# Altium project MARK1_EDU_PMOD.PrjPcb
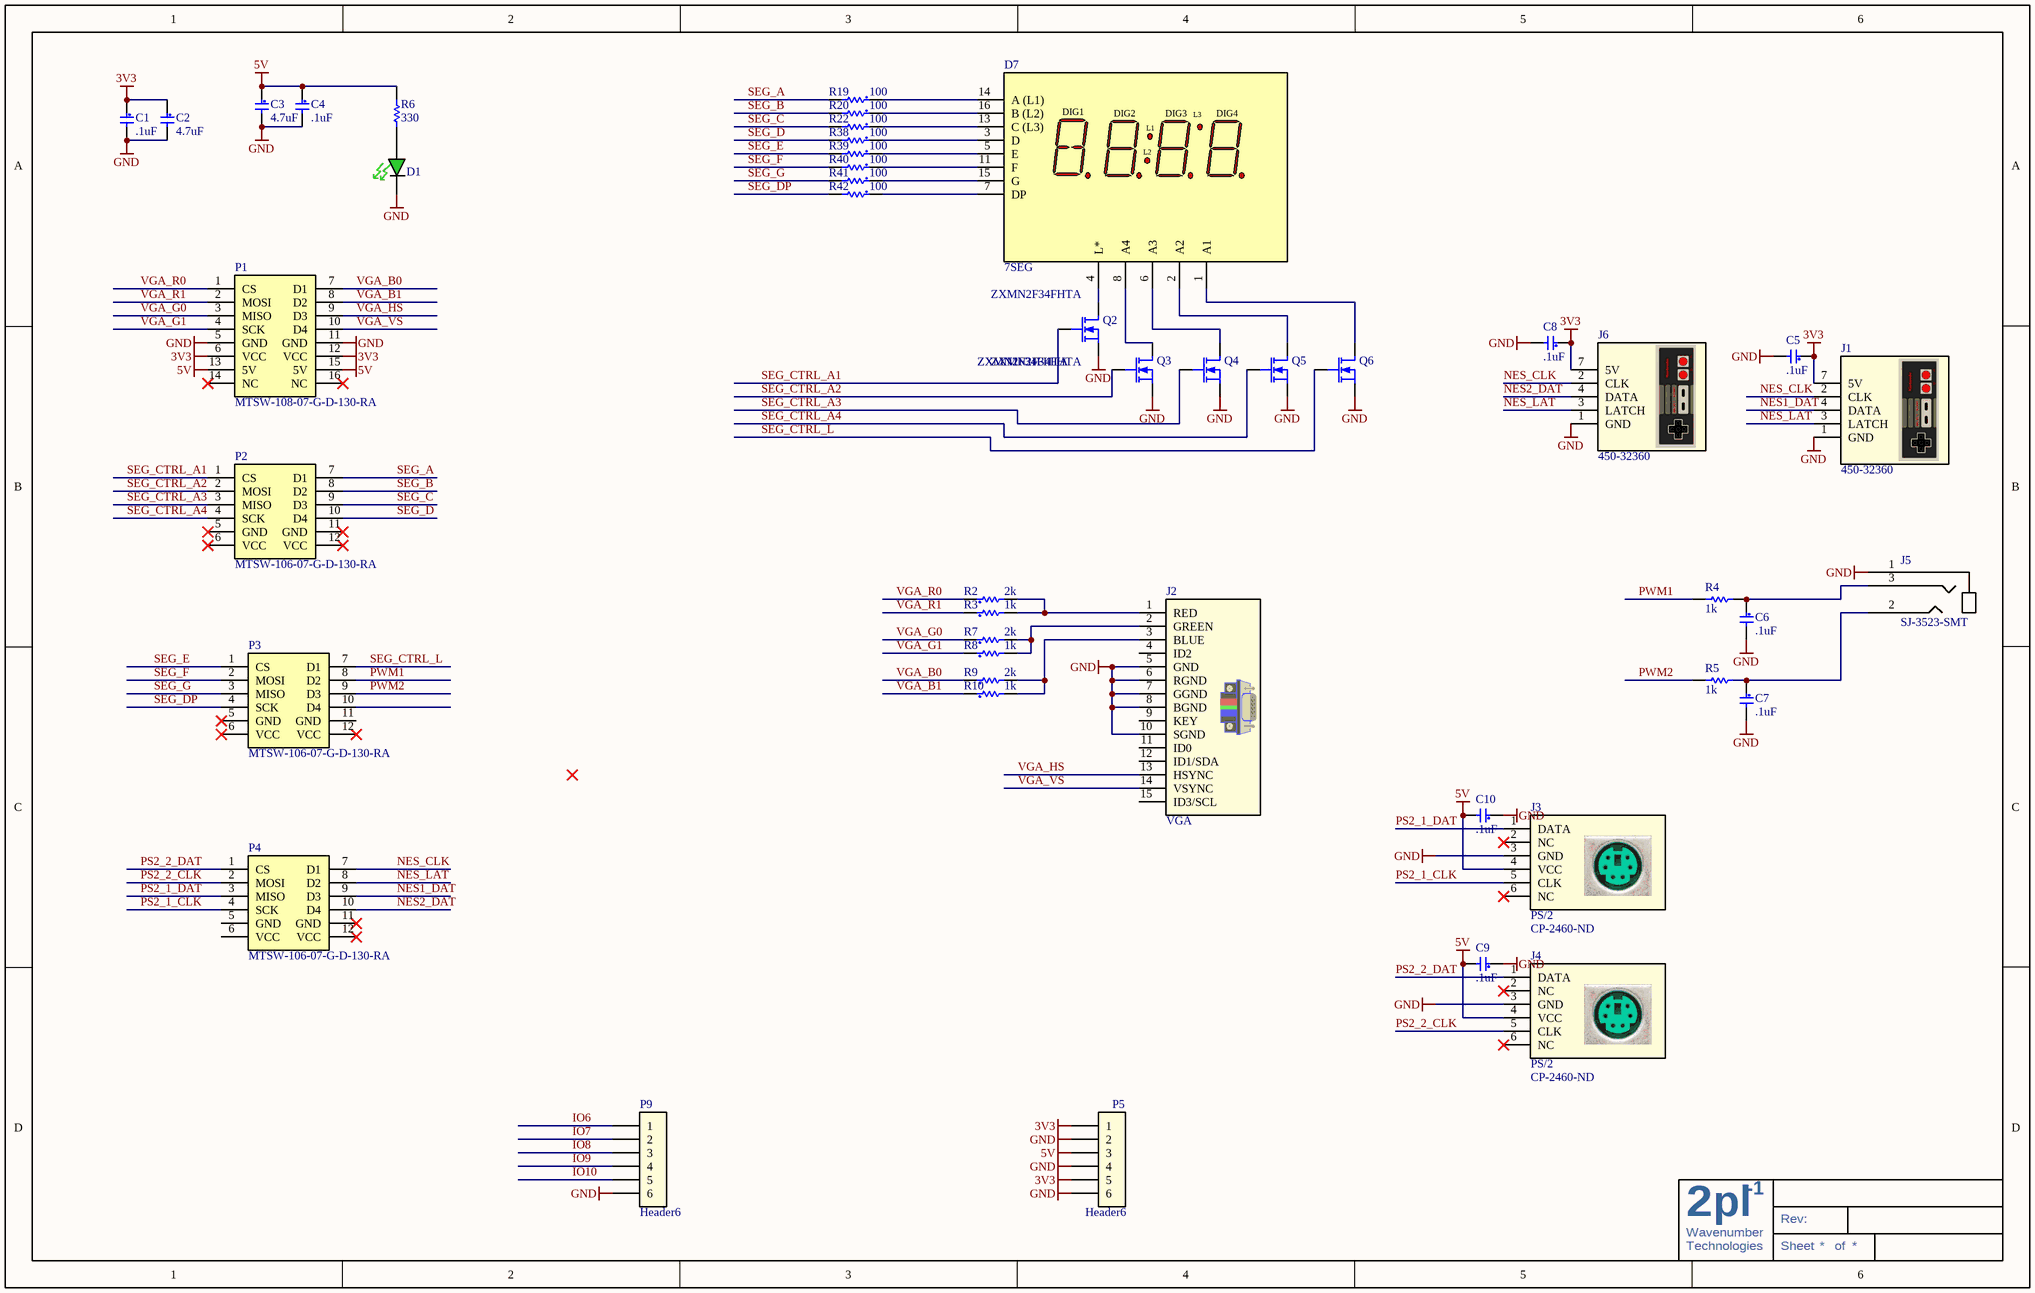
[diagram p0: MARK1_EDU_PMOD.SchDoc]
1 sheet, 46 parts. Net scope: global (net labels, ports and power ports of the same name join across sheets).
Board file: MARK1_EDU_PMOD.PcbDoc

## Sheet MARK1_EDU_PMOD.SchDoc
size B

### Parts
C1  .1uF  [C0603]
C2  4.7uF  [C0603]
C3  4.7uF  [C0603]
C4  .1uF  [C0603]
C5  .1uF  [C0603]
C6  .1uF  [C0603]
C7  .1uF  [C0603]
C8  .1uF  [C0603]
C9  .1uF  [C0603]
C10  .1uF  [C0603]
D1  LED 1.6X0.8MM 570NM GRN CLR SMD  [LED_0603 - GREEN]  (value not drawn)
D7  7SEG  [LED - SSEG - LTC-4727JR]
J1  450-32360  [NES - 450-32360]
J2  VGA  [1-1734530-1]
J3  PS/2  Supplier Part Number 1: CP-2460-ND  [MD-60S - PS/2]
J4  PS/2  Supplier Part Number 1: CP-2460-ND  [MD-60S - PS/2]
J5  SJ-3523-SMT  [SJ-3523-SMT]
J6  450-32360  [NES - 450-32360]
P1  MTSW-108-07-G-D-130-RA  [PMOD HEADER - MTSW-108-07-G-D-130-RA]
P2  MTSW-106-07-G-D-130-RA  [PMOD HEADER - Male]
P3  MTSW-106-07-G-D-130-RA  [PMOD HEADER - Male]
P4  MTSW-106-07-G-D-130-RA  [PMOD HEADER - Male]
P5  Header6  [HEADER_6_40_100 THRU SIP]
P9  Header6  [HEADER_6_40_100 THRU SIP]
Q2  ZXMN2F34FHTA  [SOT-23]
Q3  ZXMN2F34FHTA  [SOT-23]
Q4  ZXMN2F34FHTA  [SOT-23]
Q5  ZXMN2F34FHTA  [SOT-23]
Q6  ZXMN2F34FHTA  [SOT-23]  (value not drawn)
R2  2k  [R0603]
R3  1k  [R0603]
R4  1k  [R0603]
R5  1k  [R0603]
R6  330  [R0603]
R7  2k  [R0603]
R8  1k  [R0603]
R9  2k  [R0603]
R10  1k  [R0603]
R19  100  [R0603]
R20  100  [R0603]
R22  100  [R0603]
R38  100  [R0603]
R39  100  [R0603]
R40  100  [R0603]
R41  100  [R0603]
R42  100  [R0603]

### Nets
3V3: C1.1 C2.1 C5.1 C8.1 J1.7(5V) J6.7(5V) P1.6(VCC) P1.12(VCC) P5.1 P5.5
5V: C3.1 C4.1 C9.2 C10.2 J3.4(VCC) J4.4(VCC) P1.13(5V) P1.15(5V) P5.3 R6.1
GND: C1.2 C2.2 C3.2 C4.2 C5.2 C6.2 C7.2 C8.2 C9.1 C10.1 D1.C J1.1(GND) J2.5(GND) J2.6(RGND) J2.7(GGND) J2.8(BGND) J2.10(SGND) J3.3(GND) J4.3(GND) J5.1 J6.1(GND) P1.5(GND) P1.11(GND) P5.2 P5.4 P5.6 P9.6 Q2.2 Q3.2 Q4.2 Q5.2 Q6.2
IO6: P9.1
IO7: P9.2
IO8: P9.3
IO9: P9.4
IO10: P9.5
NES1_DAT: J1.4(DATA) P4.9(D3)
NES2_DAT: J6.4(DATA) P4.10(D4)
NES_CLK: J1.2(CLK) J6.2(CLK) P4.7(D1)
NES_LAT: J1.3(LATCH) J6.3(LATCH) P4.8(D2)
PS2_1_CLK: J3.5(CLK) P4.4(SCK)
PS2_1_DAT: J3.1(DATA) P4.3(MISO)
PS2_2_CLK: J4.5(CLK) P4.2(MOSI)
PS2_2_DAT: J4.1(DATA) P4.1(CS)
PWM1: P3.8(D2) R4.1
PWM2: P3.9(D3) R5.1
SEG_A: P2.7(D1) R19.2
SEG_B: P2.8(D2) R20.2
SEG_C: P2.9(D3) R22.2
SEG_CTRL_A1: P2.1(CS) Q2.1(G)
SEG_CTRL_A2: P2.2(MOSI) Q3.1(G)
SEG_CTRL_A3: P2.3(MISO) Q4.1(G)
SEG_CTRL_A4: P2.4(SCK) Q5.1(G)
SEG_CTRL_L: P3.7(D1) Q6.1(G)
SEG_D: P2.10(D4) R38.2
SEG_DP: P3.4(SCK) R42.2
SEG_E: P3.1(CS) R39.2
SEG_F: P3.2(MOSI) R40.2
SEG_G: P3.3(MISO) R41.2
VGA_B0: P1.7(D1) R9.1
VGA_B1: P1.8(D2) R10.1
VGA_G0: P1.3(MISO) R7.1
VGA_G1: P1.4(SCK) R8.1
VGA_HS: J2.13(HSYNC) P1.9(D3)
VGA_R0: P1.1(CS) R2.1
VGA_R1: P1.2(MOSI) R3.1
VGA_VS: J2.14(VSYNC) P1.10(D4)
NetC6_1: C6.1 J5.3 R4.2
NetC7_1: C7.1 J5.2 R5.2
NetD1_A: D1.A R6.2
NetD7_1: D7.1(A1) Q6.3(D)
NetD7_2: D7.2(A2) Q5.3(D)
NetD7_3: D7.3(D) R38.1
NetD7_4: D7.4(L*) Q2.3(D)
NetD7_5: D7.5(E) R39.1
NetD7_6: D7.6(A3) Q4.3(D)
NetD7_7: D7.7(DP) R42.1
NetD7_8: D7.8(A4) Q3.3(D)
NetD7_11: D7.11(F) R40.1
NetD7_13: D7.13(C_(L3)) R22.1
NetD7_14: D7.14(A_(L1)) R19.1
NetD7_15: D7.15(G) R41.1
NetD7_16: D7.16(B_(L2)) R20.1
NetJ2_1: J2.1(RED) R2.2 R3.2
NetJ2_2: J2.2(GREEN) R7.2 R8.2
NetJ2_3: J2.3(BLUE) R9.2 R10.2

Not connected (* = marked no-connect by the designer): J2 4(ID2) 9(KEY) 11(ID0) 12(ID1/SDA) 15(ID3/SCL); J3 2(NC)* 6(NC)*; J4 2(NC)* 6(NC)*; P1 14(NC)* 16(NC)*; P2 5(GND)* 6(VCC)* 11(GND)* 12(VCC)*; P3 5(GND)* 6(VCC)* 10(D4) 11(GND) 12(VCC)*; P4 5(GND) 6(VCC) 11(GND)* 12(VCC)*

### Notes on the sheet
- 2
- Wavenumber
- pl
- -1
- Rev:
- Technologies
- Sheet
- of
- (in symbol LED - SSEG - LTC-4727JR) DIG1; DIG2; DIG3; L3; DIG4; L1; L2

### Library data of the parts
C1 C4-C10 = C0603 - GRM188R71H104KA93D: 0.1uF 50volts X7R 10% MLCC SMD/SMT 0603; Manufacturer: Murata; Description: Multilayer Ceramic Capacitors (MLCC) - SMD/SMT 0603 0.1uF 50volts X7R 10%; Supplier 1: Mouser; Manufacturer Part Number: GRM188R71H104KA93D; RoHS: RoHS Compliant By Exemption; Category: Multilayer Ceramic Capacitors (MLCC) - SMD/SMT; Stock 1: 327594; Pricing 1: 1=0.081, 50=0.054, 100=0.041, 500=0.018, 1000=0.015, 4000=0.012 (AUD); Capacitance: 0.1 uF; Dimensions: 0.8 mm W x 1.6 mm L x 0.8 mm H; Operating Temperature Range: - 55 C to + 125 C; Package / Case: 0603 (1608 metric); Packaging: Reel; Product: General Type MLCCs; Series: GRM; Termination Style: SMD/SMT; Tolerance: 10 %; Voltage Rating: 50 Volts; Product Category: Low & Medium Capacitance SMD Ceramic Chip Capacitors; Standard Pack Qty: 4000; Temperature Coefficient / Code: X7R; RoHS - Mouser: E; Minimum Order Quantity: 1; Reeling: True; ComponentLink1URL: http://www.murata.com/products/catalog/pdf/c02e.pdf; ComponentLink1Description: http://www.murata.com/products/catalog/pdf/c02e.pdf; Supplier Part Number 1: 81-GRM39X104K50D; Value: .1uF
C2 C3 = C0603 - GRM188F51A475ZE20D: 4.7uF 10volts Y5V +80-20% (MLCC) - SMD/SMT 0603; Manufacturer: Murata; Description: Multilayer Ceramic Capacitors (MLCC) - SMD/SMT 0603 4.7uF 10volts Y5V +80-20%; Tolerance: - 20 %, + 80 %; Supplier 1: Mouser; Manufacturer Part Number: GRM188F51A475ZE20D; RoHS: RoHS Compliant By Exemption; Category: Multilayer Ceramic Capacitors (MLCC) - SMD/SMT; Stock 1: 32662; Pricing 1: 1=0.257, 50=0.159, 100=0.123, 500=0.065, 1000=0.046, 4000=0.032, 8000=0.028, 12000=0.024 (AUD); Capacitance: 4.7 uF; Dimensions: 0.8 mm W x 1.6 mm L x 0.8 mm H; Operating Temperature Range: - 30 C to + 85 C; Package / Case: 0603 (1608 metric); Packaging: Reel; Product: General Type MLCCs; Series: GRM; Termination Style: SMD/SMT; Voltage Rating: 10 Volts; Product Category: High Capacitance SMD Ceramic Chip Capacitors; Standard Pack Qty: 4000; Temperature Coefficient / Code: Y5V; RoHS - Mouser: E; Minimum Order Quantity: 1; Reeling: True; ComponentLink1URL: http://www.murata.com/products/catalog/pdf/c02e.pdf; ComponentLink1Description: http://www.murata.com/products/catalog/pdf/c02e.pdf; Supplier Part Number 1: 81-GRM188F51A475ZE20; Value: 4.7uF
D1 = APT1608CGCK: Manufacturer: Kingbright Corp; Color: Green; Current - Test: 20mA; Wavelength - Peak: 574nm; Millicandela Rating: 50mcd; Voltage - Forward (Vf) Typ: 2.1V; Lens Type: Clear; Lens Style/Size: Rectangle, 1.2mm x 0.8mm; Viewing Angle: 120°; Value: LED 1.6X0.8MM 570NM GRN CLR SMD; Supplier 1: Digi-Key; Supplier Part Number 1: 754-1116-2-ND; Manufacturer Part Number: APT1608CGCK; RoHS: RoHS Compliant; Description: LED 1.6X0.8MM 570NM GRN CLR SMD; Category: Optoelectronics; Stock 1: 94000; Pricing 1: 2000=0.051, 6000=0.045, 10000=0.043 (USD); Luminous Flux @ Current - Test: -; Wavelength - Dominant: 570nm; Size / Dimension: 1.60mm L x 0.80mm W; Height: 0.75mm; Package / Case: 0603 (1608 Metric); Mounting Type: Surface Mount; Packaging: Tape & Reel (TR); ComponentLink1URL: http://www.us.kingbright.com/images/catalog/SPEC/APT1608CGCK.pdf; ComponentLink1Description: http://www.us.kingbright.com/images/catalog/SPEC/APT1608CGCK.pdf
D7 = LED - SSEG - LTC-4727JR: LED Displays & Accessories 4 Digit, Red Low Current; Manufacturer: Lite-On; Character Size: 10 mm; Display Type: 7 Segment; Operating Voltage: 2 V; Power Consumption: 70 mW; Wavelength: 631 nm; Common Pin: Common Cathode; Luminous Intensity: 975 ucd; Operating Current: 25 mA; Number of Digits: 4; Supplier 1: Mouser; Manufacturer Part Number: LTC-4727JR; RoHS: RoHS Compliant; Category: LED Displays & Accessories; Stock 1: 1398; Pricing 1: 1=2.88, 10=2.74, 50=2.67, 100=2.61, 500=2.31 (AUD); Illumination Color: Red; Packaging: Tube; Maximum Operating Temperature: + 85 C; Minimum Operating Temperature: - 35 C; Product Category: Numeric Display; Standard Pack Qty: 12; RoHS - Mouser: Y; Minimum Order Quantity: 1; Reeling: False; ComponentLink1URL: http://optoelectronics.liteon.com/en-us/product/detail.aspx?txtSpecNo=DS30-2000-193&txtPartNo=LTC-4727JR; ComponentLink1Description: http://optoelectronics.liteon.com/en-us/product/detail.aspx?txtSpecNo=DS30-2000-193&txtPartNo=LTC-4727JR
J1 J6 = 450-32360: NES CONTROLLER SOCKET; Manufacturer: Parallax Inc; Accessory Type: Adapter NES Controller Socket; For Use With/Related Products: Game Systems, Development, Hobby and Education Projects; Supplier 1: Digi-Key; Manufacturer Part Number: 450-32360; RoHS: RoHS Compliant; Category: Programmers, Development Systems; Stock 1: 7; Pricing 1: 1=1.99 (USD); Supplier 2: Mouser; Stock 2: 0; Pricing 2: 1=1.85 (USD); Product Category: Basic Stamp Accessories; RoHS - Mouser: Y; Minimum Order Quantity: 1; Reeling: False; Supplier Part Number 1: 450-32360-ND; Supplier Part Number 2: 619-450-32360; Value: 450-32360
J2 = VGA - 1-1734530-1: CONN HD D-SUB RCPT R/A 15POS; Manufacturer: TE Connectivity; Connector Style: D-Sub, High Density; Number of Positions: 15; Connector Type: Receptacle, Female Sockets; Flange Feature: Housing/Shell (4-40); Voltage Rating: 125V; Current Rating: 2A; Supplier 1: Digi-Key; Manufacturer Part Number: 1-1734530-1; RoHS: RoHS Compliant; Category: Connectors, Interconnects; Stock 1: 6957; Pricing 1: 1=1.96, 10=1.779, 25=1.67, 50=1.5976, 100=1.525, 250=1.37972, 500=1.2708, 1000=1.08926, 2500=1.01664 (USD); Number of Rows: 3; Shell Size, Connector Layout: 1 (DE, E) High Density; Contact Type: Signal; Mounting Type: Through Hole, Right Angle; Termination: Solder; Features: Board Lock; Shell Material, Finish: Steel, Nickel Plated; Contact Finish: Gold; Contact Finish Thickness: Flash; Ingress Protection: -; Operating Temperature: -55°C ~ 105°C; Housing Material: Thermoplastic; Color: Black; ComponentLink1URL: http://documents.tycoelectronics.com/commerce/DocumentDelivery/DDEController?Action=srchrtrv&DocNm=1734530&DocType=CD&DocLang=EN; ComponentLink1Description: http://documents.tycoelectronics.com/commerce/DocumentDelivery/DDEController?Action=srchrtrv&DocNm=1734530&DocType=CD&DocLang=EN
J3 J4 = Con - D-60S: CONN MINIDIN RECPT UNSHIELD 6POS - PS/2 mouse - keybaord; Manufacturer: CUI Inc; Manufacturer Part Number: MD-60S; Connector Type: Receptacle, Female Sockets; Number of Positions: 6; Current Rating: 2A; Voltage - Rated: 12VDC; Supplier 1: Digi-Key; RoHS: RoHS Compliant; Description: CONN MINIDIN RECPT UNSHIELD 6POS; Category: Connectors, Interconnects; Stock 1: 13581; Pricing 1: 1=1.31, 10=1.018, 100=0.7763, 500=0.621, 1000=0.552, 2500=0.45885 (USD); Shell Size - Insert: Mini DIN; Shell Size, MIL: -; Mounting Type: Through Hole, Right Angle; Termination: Solder; Fastening Type: Push-Pull; Orientation: Keyed; Ingress Protection: -; Shell Material, Finish: Polybutylene Terephthalate (PBT); Contact Finish: Silver; Features: -; Packaging: Bulk; Contact Finish Thickness: -; Operating Temperature: -; ComponentLink1URL: http://products.cui.com/GetSpecForDigiKey.aspx?MFGNum=MD-60S; ComponentLink1Description: http://products.cui.com/GetSpecForDigiKey.aspx?MFGNum=MD-60S; Value: PS/2
J5 = SJ-3523-SMT: CONN AUDIO JACK 3.5MM STEREO SMD; Manufacturer: CUI Inc; Source Part Number: CP-3523SJCT-ND; Connector Type: Phone Jack; Gender: Female; Plug/Mating Plug Diameter: 3.50mm (0.141", 1/8", Mini Plug) - Headphone; Number of Positions/Contacts: 3 Conductors, 3 Contacts; Internal Switch(s): Does Not Contain Switch; Shielding: Unshielded; Color - Contact: Black; Voltage - Rated: 12VDC; Current Rating: 1A; Manufacturer Part Number: SJ-3523-SMT; Source: Digikey; ROHS Certificate: ROHS-CUI.pdf; Supplier 1: Digi-Key; Supplier Part Number 1: CP-3523SJCT-ND; RoHS: RoHS Compliant; Category: Connectors, Interconnects; Stock 1: 68095; Pricing 1: 1=1.34, 10=1.043, 100=0.7961, 500=0.63558 (USD); Signal Lines: Stereo; Mounting Type: Surface Mount, Right Angle; Termination: Solder; Features: -; Contact Material: Copper Alloy; Contact Material - Plating: Silver; Housing Material: Plastic; Housing Color: Black; Operating Temperature: -25°C ~ 85°C; Packaging: Cut Tape (CT); ComponentLink1URL: http://products.cui.com/GetSpecForDigiKey.aspx?MFGNum=SJ-3523-SMT; ComponentLink1Description: http://products.cui.com/GetSpecForDigiKey.aspx?MFGNum=SJ-3523-SMT; Value: SJ-3523-SMT
P1 = P-MOD - MTSW-108-07-G-D-130-RA: Samtec Male Conn Unshrouded Header HDR 16 POS 2.54mm Solder RA Thru-Hole; Description: Conn Unshrouded Header HDR 12 POS 2.54mm Solder RA Thru-Hole; Lead Time: 0 weeks; Peak Solder Temperature: 260 deg C; MSL (Moisture Sensitivity Level): N/R; Supplier 1: Arrow; Manufacturer: Samtec; Manufacturer Part Number: MTSW-108-07-G-D-130-RA; RoHS: CHINA ROHS: Compliant / EU ROHS: Compliant; Stock 1: 0; Termination Finish: Au/Ni; China ROHS Lead (X -> above / O -> below threshold): O; China ROHS Mercury (X -> above / O -> below threshold): O; China ROHS Cadmium (X -> above / O -> below threshold): O; China ROHS Hex Chromium (X -> above / O -> below threshold): O; China ROHS PBB (X -> above / O -> below threshold): O; China ROHS PBDE (X -> above / O -> below threshold): O; EU_ROHS_PROD_EXEMPTION_BY_SUPP: N/R; ComponentLink1URL: http://components.arrow.com/partservice/dataview/altium/2717179?apiKey=aa438727d59eed98c4bed826d8d949c84cb5e685b92bf87346a0226bd2658797; ComponentLink1Description: http://components.arrow.com/partservice/dataview/altium/2717179?apiKey=aa438727d59eed98c4bed826d8d949c84cb5e685b92bf87346a0226bd2658797; Supplier Part Number 1: 2717179; =Value: MTSW-108-07-G-D-130-RA; Value: MTSW-108-07-G-D-130-RA
P2-P4 = P-MOD - MTSW-106-07-G-D-130-RA: Samtec Male Conn Unshrouded Header HDR 12 POS 2.54mm Solder RA Thru-Hole; Lead Time: 0 weeks; Peak Solder Temperature: 260 deg C; MSL (Moisture Sensitivity Level): N/R; Supplier 1: Arrow; Manufacturer: Samtec; Manufacturer Part Number: MTSW-106-07-G-D-130-RA; RoHS: CHINA ROHS: Compliant / EU ROHS: Compliant; Description: Conn Unshrouded Header HDR 12 POS 2.54mm Solder RA Thru-Hole; Stock 1: 0; Termination Finish: Au/Ni; China ROHS Lead (X -> above / O -> below threshold): O; China ROHS Mercury (X -> above / O -> below threshold): O; China ROHS Cadmium (X -> above / O -> below threshold): O; China ROHS Hex Chromium (X -> above / O -> below threshold): O; China ROHS PBB (X -> above / O -> below threshold): O; China ROHS PBDE (X -> above / O -> below threshold): O; EU_ROHS_PROD_EXEMPTION_BY_SUPP: N/R; ComponentLink1URL: http://components.arrow.com/partservice/dataview/altium/2717179?apiKey=aa438727d59eed98c4bed826d8d949c84cb5e685b92bf87346a0226bd2658797; ComponentLink1Description: http://components.arrow.com/partservice/dataview/altium/2717179?apiKey=aa438727d59eed98c4bed826d8d949c84cb5e685b92bf87346a0226bd2658797; Supplier Part Number 1: 2717179; =Value: MTSW-106-07-G-D-130-RA; Value: MTSW-106-07-G-D-130-RA
P5 P9 = Header6: Header 6 pin
Q2-Q6 = ZXMN2F34FHTA: MOSFET N-CHAN 20V SOT23-3; Manufacturer: Diodes/Zetex; FET Type: MOSFET N-Channel, Metal Oxide; FET Feature: Logic Level Gate; Rds On (Max) @ Id, Vgs: 60 mOhm @ 2.5A, 4.5V; Current - Continuous Drain (Id) @ 25° C: 3.4A; Vgs(th) (Max) @ Id: 1.5V @ 250µA; Gate Charge (Qg) @ Vgs: 2.8nC @ 4.5V; Input Capacitance (Ciss) @ Vds: 277pF @ 10V; Power - Max: 950mW; Supplier 1: Digi-Key; Manufacturer Part Number: ZXMN2F34FHTA; RoHS: RoHS Compliant; Category: Discrete Semiconductor Products; Stock 1: 24122; Pricing 1: 1=0.55, 10=0.433, 100=0.2964, 250=0.247, 500=0.2052, 1000=0.152 (USD); Drain to Source Voltage (Vdss): 20V; Mounting Type: Surface Mount; Package / Case: SOT-23-3, TO-236-3, Micro3™, SSD3, SST3; Packaging: Cut Tape (CT); Supplier Device Package: *; ComponentLink1URL: http://www.diodes.com/datasheets/ZXMN2F34FH.pdf; ComponentLink1Description: http://www.diodes.com/datasheets/ZXMN2F34FH.pdf; Supplier Part Number 1: ZXMN2F34FHCT-ND; Value: ZXMN2F34FHTA
R2 R7 R9 = R0603 - ERJ-3EKF2001V: RES 2.00K OHM 1/10W 1% 0603 SMD; Manufacturer: Panasonic - ECG; Power (Watts): 0.1W, 1/10W; Temperature Coefficient: ±100ppm/°C; Supplier 1: Digi-Key; Manufacturer Part Number: ERJ-3EKF2001V; RoHS: RoHS Compliant; Category: Resistors; Stock 1: 771261; Pricing 1: 1=0.1, 50=0.0138, 100=0.0105, 250=0.0078, 500=0.00576, 1000=0.00384 (USD); Resistance (Ohms): 2K; Composition: Thick Film; Features: -; Tolerance: ±1%; Package / Case: 0603 (1608 Metric); Size / Dimension: 0.063" L x 0.031" W (1.60mm x 0.80mm); Height: 0.022" (0.55mm); Number of Terminations: 2; Packaging: Cut Tape (CT); ComponentLink1URL: http://industrial.panasonic.com/www-cgi/jvcr13pz.cgi?E+PZ+3+AOA0002+ERJ3EKF2001V+7+WW; ComponentLink1Description: http://industrial.panasonic.com/www-cgi/jvcr13pz.cgi?E+PZ+3+AOA0002+ERJ3EKF2001V+7+WW; Supplier Part Number 1: P2.00KHCT-ND; Value: 2k
R3 R8 R10 = R0603 - ERJ-3EKF1001V: 1Kohms 1% Thick Film Resistors - SMD 0603  Tol; Manufacturer: Panasonic Electronic Components; Description: Thick Film Resistors - SMD 0603 1Kohms 1% Tol; Power Rating: 0.1 Watt (1/10 Watt); Temperature Coefficient: 100 PPM / C; Product Status: New at Mouser; Supplier 1: Mouser; Manufacturer Part Number: ERJ-3EKF1001V; RoHS: RoHS Compliant By Exemption; Category: Thick Film Resistors - SMD; Stock 1: 226610; Pricing 1: 1=0.054, 25=0.020, 100=0.014, 250=0.009, 500=0.007, 1000=0.004, 2000=0.003 (AUD); Dimensions: 0.8 mm W x 1.6 mm L x 0.45 mm H; Operating Temperature Range: - 55 C to + 125 C; Package / Case: 0603 (1608 metric); Packaging: Reel; Product: Thick Film Resistors SMD; Resistance: 1 KOhms; Series: ERJ; Termination Style: SMD/SMT; Tolerance: 1 %; Standard Pack Qty: 5000; RoHS - Mouser: E; Minimum Order Quantity: 1; Reeling: True; ComponentLink1URL: http://www.panasonic.com/industrial/components/pdf/AOA0000CE2.pdf; ComponentLink1Description: http://www.panasonic.com/industrial/components/pdf/AOA0000CE2.pdf; Supplier Part Number 1: 667-ERJ-3EKF1001V; Value: 1k
R4 R5 = ERJ-3EKF1001V: RES 1.00K OHM 1/10W 1% 0603 SMD; Manufacturer: Panasonic - ECG; Power (Watts): 0.1W, 1/10W; Temperature Coefficient: ±100ppm/°C; Supplier 1: Digi-Key; Manufacturer Part Number: ERJ-3EKF1001V; RoHS: RoHS Compliant; Category: Resistors; Stock 1: 7422563; Pricing 1: 1=0.04, 50=0.015, 100=0.0114, 250=0.00844, 500=0.00624, 1000=0.00416 (USD); Resistance (Ohms): 1.00K; Composition: Thick Film; Features: -; Tolerance: ±1%; Size / Dimension: 0.063" L x 0.031" W (1.60mm x 0.80mm); Height: 0.018" (0.45mm); Lead Style: Surface Mount (SMD - SMT); Packaging: Cut Tape (CT); Package / Case: 0603 (1608 Metric); ComponentLink1URL: http://industrial.panasonic.com/www-cgi/jvcr13pz.cgi?E+PZ+3+AOA0002+ERJ3EKF1001V+7+WW; ComponentLink1Description: http://industrial.panasonic.com/www-cgi/jvcr13pz.cgi?E+PZ+3+AOA0002+ERJ3EKF1001V+7+WW; Value: 1k; Supplier Part Number 1: P1.00KHCT-ND
R6 = ERJ-3EKF3300V: RES 330 OHM 1/10W 1% 0603 SMD; Manufacturer: Panasonic - ECG; Power (Watts): 0.1W, 1/10W; Temperature Coefficient: ±100ppm/°C; Manufacturer Part Number: ERJ-3EKF3300V; Value: RES 330 OHM 1/10W 1% 0603 SMD; Supplier 1: Digi-Key; Supplier Part Number 1: P330HCT-ND; RoHS: RoHS Compliant; Category: Resistors; Stock 1: 592917; Pricing 1: 1=0.04, 50=0.015, 100=0.0114, 250=0.00844, 500=0.00624, 1000=0.00416 (USD); Resistance (Ohms): 330; Composition: Thick Film; Features: -; Tolerance: ±1%; Size / Dimension: 0.063" L x 0.031" W (1.60mm x 0.80mm); Height: 0.018" (0.45mm); Lead Style: Surface Mount (SMD - SMT); Packaging: Cut Tape (CT); Package / Case: 0603 (1608 Metric); ComponentLink1URL: http://industrial.panasonic.com/www-cgi/jvcr13pz.cgi?E+PZ+3+AOA0002+ERJ3EKF3300V+7+WW; ComponentLink1Description: http://industrial.panasonic.com/www-cgi/jvcr13pz.cgi?E+PZ+3+AOA0002+ERJ3EKF3300V+7+WW
R19 R20 R22 R38-R42 = Res-Eli: RES 10.0K OHM 1/10W 1% 0603 SMD; Manufacturer: Panasonic - ECG; Manufacturer Part Number: ERJ-3EKF1002V; Power (Watts): 0.1W, 1/10W; Temperature Coefficient: ±100ppm/°C; Value: 100; Supplier 1: Digi-Key; RoHS: RoHS Compliant; Category: Resistors; Stock 1: 11168880; Pricing 1: 1=0.04, 50=0.015, 100=0.0114, 250=0.00844, 500=0.00624, 1000=0.00416 (USD); Resistance (Ohms): 10.0K; Composition: Thick Film; Features: -; Tolerance: ±1%; Size / Dimension: 0.063" L x 0.031" W (1.60mm x 0.80mm); Height: 0.018" (0.45mm); Lead Style: Surface Mount (SMD - SMT); Packaging: Cut Tape (CT); Package / Case: 0603 (1608 Metric); ComponentLink1URL: http://industrial.panasonic.com/www-cgi/jvcr13pz.cgi?E+PZ+3+AOA0002+ERJ3EKF1002V+7+WW; ComponentLink1Description: http://industrial.panasonic.com/www-cgi/jvcr13pz.cgi?E+PZ+3+AOA0002+ERJ3EKF1002V+7+WW; Supplier Part Number 1: P10.0KHCT-ND